# Altium schematic sheet Sensors.SchDoc: Sensors
size 431 x 279 mm; ApprovedBy: Wuji Zhang; CheckedBy: Wuji Zhang; Author: Wuji Zhang; CompanyName: Upenn; DrawnBy: Wuji Zhang; Engineer: Wuji Zhang; Organization: Upenn; Address1: ADDRESS 1; Address2: ADDRESS 2; Address3: ADDRESS 3; Address4: ADDRESS 4; Revision: -; SheetNumber: 8; SheetTotal: 8; ENG_APP_DATE: --/--/--; DSN_APP_DATE: --/--/--; CHK_APP_DATE: --/--/--
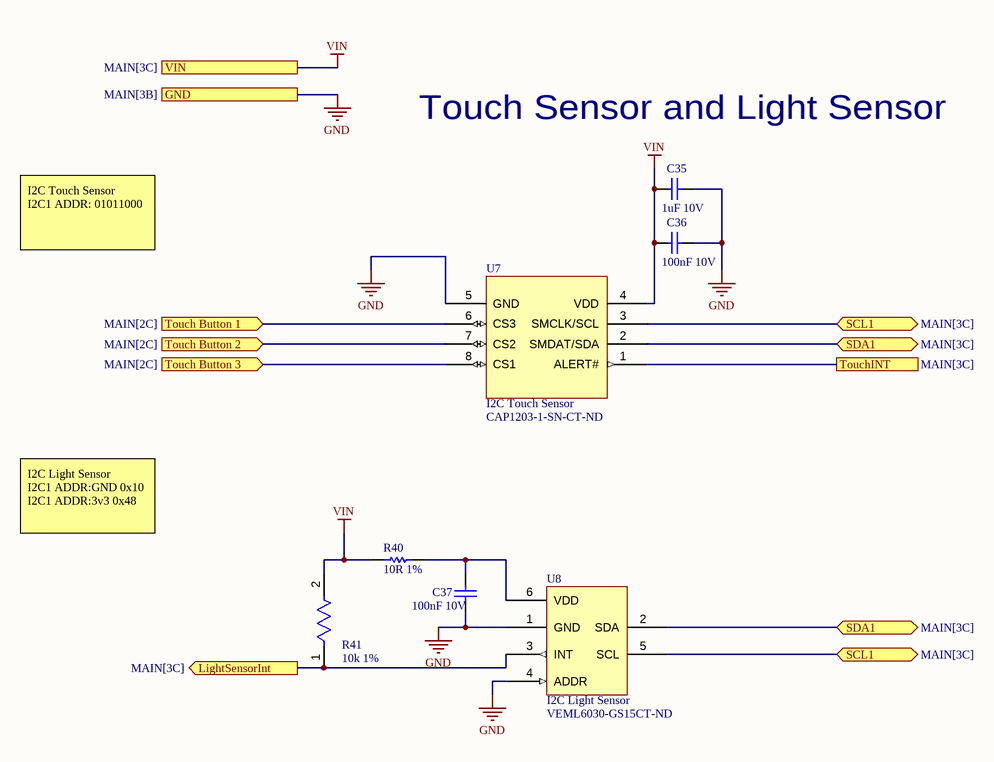
[diagram p0: Sensors.SchDoc]

## Parts
C35  1uF 10V  [CAPC0402(1005)60_N]
C36  100nF 10V  [CAPC0402(1005)60_L]
C37  100nF 10V  [CAPC0402(1005)60_L]
R40  10R 1%  [RESC0402(1005)_N]
R41  10k 1%  [FP-CRCW0402-e3-IPC_C]
U7  I2C Touch Sensor  Supplier Part Number 1: CAP1203-1-SN-CT-ND  [CAP1203-1-SN-TR]
U8  I2C Light Sensor  Supplier Part Number 1: VEML6030-GS15CT-ND  [CAC-65P200X200-6N]

## Ports
GND (see MAIN[3B]), LightSensorInt (out, see MAIN[3C]), SCL1 (bidir, see MAIN[3C]), SDA1 (bidir, see MAIN[3C]), Touch Button 1 (in, see MAIN[2C]), Touch Button 2 (in, see MAIN[2C]), Touch Button 3 (in, see MAIN[2C]), TouchINT (see MAIN[3C]), VIN (see MAIN[3C])

## Nets
GND: C35.2 C36.2 C37.1 U7.5(GND) U8.1(GND) U8.4(ADDR) ; port GND
VIN: C35.1 C36.1 R40.1 R41.2 U7.4(VDD) ; port VIN
LightSensorInt: R41.1 U8.3(INT) ; port LightSensorInt
SCL1: U7.3(SMCLK/SCL) U8.5(SCL) ; port SCL1
SDA1: U7.2(SMDAT/SDA) U8.2(SDA) ; port SDA1
Touch Button 1: U7.6(CS3) ; port Touch Button 1
Touch Button 2: U7.7(CS2) ; port Touch Button 2
Touch Button 3: U7.8(CS1) ; port Touch Button 3
TouchINT: U7.1(ALERT#) ; port TouchINT
NetC37_2: C37.2 R40.2 U8.6(VDD)

## Notes on the sheet
- Touch Sensor and Light Sensor
- I2C Touch Sensor     I2C1 ADDR: 01011000
- I2C Light Sensor     I2C1 ADDR:GND 0x10 I2C1 ADDR:3v3 0x48
- DWG. NO.
- REV.
- SHT.
- THIS DOCUMENT AND THE DATA DISCLOSED HEREIN OR HEREWITH IS THE PROPERTY OF ALTIUM LIMITED AND MAY BE FREELY DISTRIBUTED IN WHOLE. NO RIGHTS ARE RESERVED OR EXPRESS OR IMPLIED WARANTEE GIVEN.
- REVISION
- DESCRIPTION
- DATE
- APPROVED
- ENG:
- APPROVALS
- PROJECT
- DSN:
- CHK:
- REFERENCE DOCUMENTS
- PROJECT REVISION:
- TITLE
- DOCUMENT REVISION:
- DESIGN ITEM:
- BOM:
- FAB DWG:
- PCB DWG:
- ASSY DWG:
- SCALE:
- SIZE
- B
- CAGE CODE
- FILE NAME
- DWG NO.
- SHEET
- OF
- REV

## Library data of the parts
C35 = CMP-1034-02116-1: CAP 1uF 10V ±10% 0402 (1005 Metric) Thickness 0.6mm SMD; Tolerance: Â±10%; Case-Metric: 1005; Case-EIA: 0402; Value: 1uF; Technology: SMT; Max Thickness: 0.6 mm; Rated Voltage: 10 V
C36 C37 = CMP-1034-02064-1: CAP 100nF 10V ±5% 0402 (1005 Metric) Thickness 0.6mm SMD; Tolerance: Â±5%; Case-EIA: 0402; Case-Metric: 1005; Max Thickness: 0.6 mm; Value: 100nF; Rated Voltage: 10 V; Technology: SMT
R40 = CMP-1011-00284-1: 10R 0.063W 1% 0402 (1005 Metric)  SMD; Case-EIA: 0402; Case-Metric: 1005; Value: 10.00 Ohm; Power: 0.063 W; Technology: SMT; Tolerance: 1 %
R41 = CMP-1011-00623-2: RES Thick Film, 10kΩ, 1%, 0.063W, 100ppm/°C, 0402; Max Power Dissipation: 63mW; Resistance: 10kR; Tolerance: 1%; Case/Package: 0402; Case Code (Imperial): 0402; Case Code (Metric): 1005; Composition: Thick Film; Contact Plating: Tin; Depth: 0.5mm; Features: Automotive AEC-Q200; Height: 0.016inch; Lead Free: Lead Free; Length: 0.039inch; Max Operating Temperature: 155°C; Military Standard: Not; Min Operating Temperature: -55°C; Number of Terminations: 2; Packaging: Tape and Reel; Radiation Hardening: No; Temperature Coefficient: 100ppm/°C; Width: 0.02inch
U7 = CAP1203-1-SN-TR: Sensor Controller Capacitive 3-CH I2C 8-Pin SOIC T/R; Manufacturer: Microchip; Supplier 1: Digi-Key; Manufacturer Part Number: CAP1203-1-SN-TR; RoHS: No; Category: Integrated Circuits (ICs); Stock 1: 7847; Pricing 1: 1=0.55000, 25=0.50000, 100=0.45000 (USD); ComponentLink1URL: http://www.microchip.com/mymicrochip/filehandler.aspx?ddocname=en566286&src-supplier=Digi-Key; ComponentLink1Description: http://www.microchip.com/mymicrochip/filehandler.aspx?ddocname=en566286&src-supplier=Digi-Key
U8 = VEML6030-GS15: HIGH ACCURACY AMBIENT LIGHT SENS; Manufacturer: Vishay Semiconductors; Wavelength: 550nm; Supplier 1: Digi-Key; Manufacturer Part Number: VEML6030-GS15; RoHS: Yes; Category: Sensors; Stock 1: 1378; Pricing 1: 1=2.00000, 5=1.89000, 10=1.62000, 25=1.29600, 50=1.18800, 100=1.08000, 500=0.94500, 1000=0.83700, 5000=0.78300 (USD); Mount: Surface Mount; Case/Package: SMD/SMT; Min Operating Temperature: -25°C; Max Operating Temperature: 85°C; Output Type: I2C; Packaging: Tape and Reel; RoHS Compliant: Yes; ComponentLink1URL: http://www.vishay.com/docs/84366/veml6030.pdf?src-supplier=Digi-Key; ComponentLink1Description: http://www.vishay.com/docs/84366/veml6030.pdf?src-supplier=Digi-Key